# EasyEDA Pro project ProPrj_Syntheseproject 2025-2026_2025-11-26 (1).epro

# Schematic Schematic1

## Sheets
1 Totaal: Board Name: Board1; Create Date: 2025-10-10; Page Name: Totaal; Project Name: Syntheseproject 2025-2026; Schematic Name: Schematic1; Update Date: 2025-10-24; Company: EasyEDA.com; Page Size: A4; Version: V1.0
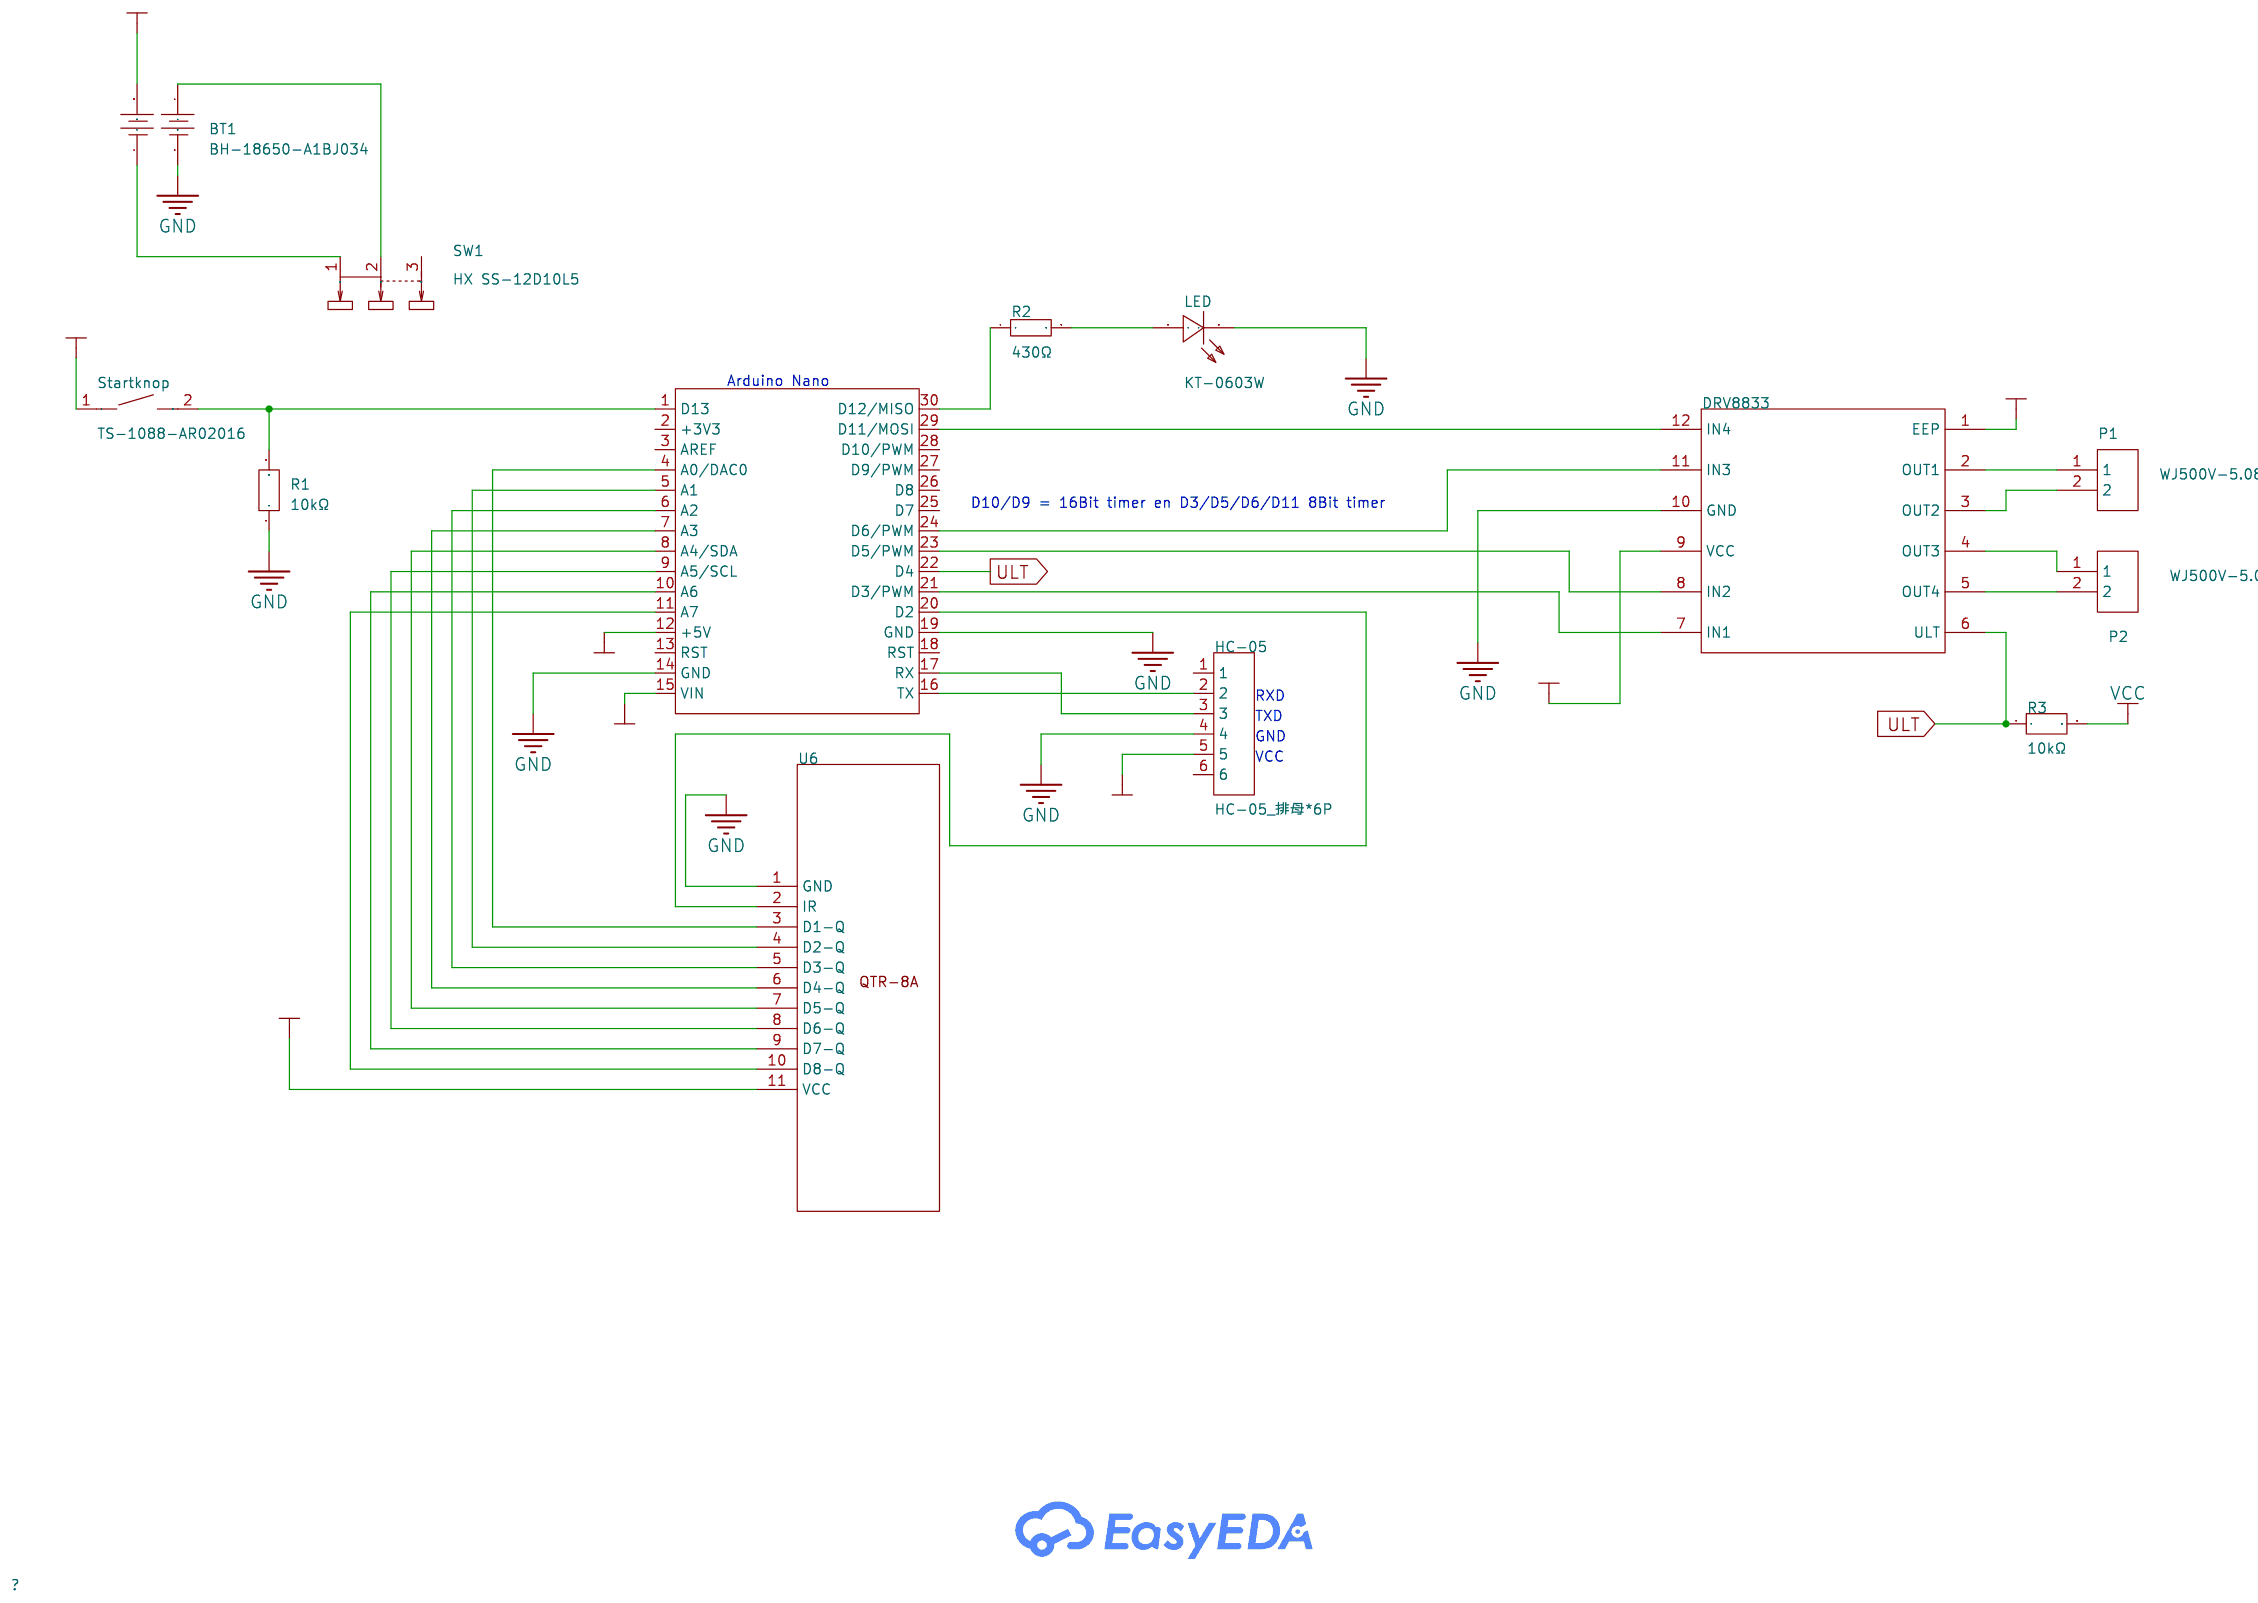
[diagram p0: Totaal]
2 Deelschema-Drive: Create Date: 2025-10-17; Page Name: Deelschema-Drive; Update Date: 2025-10-17
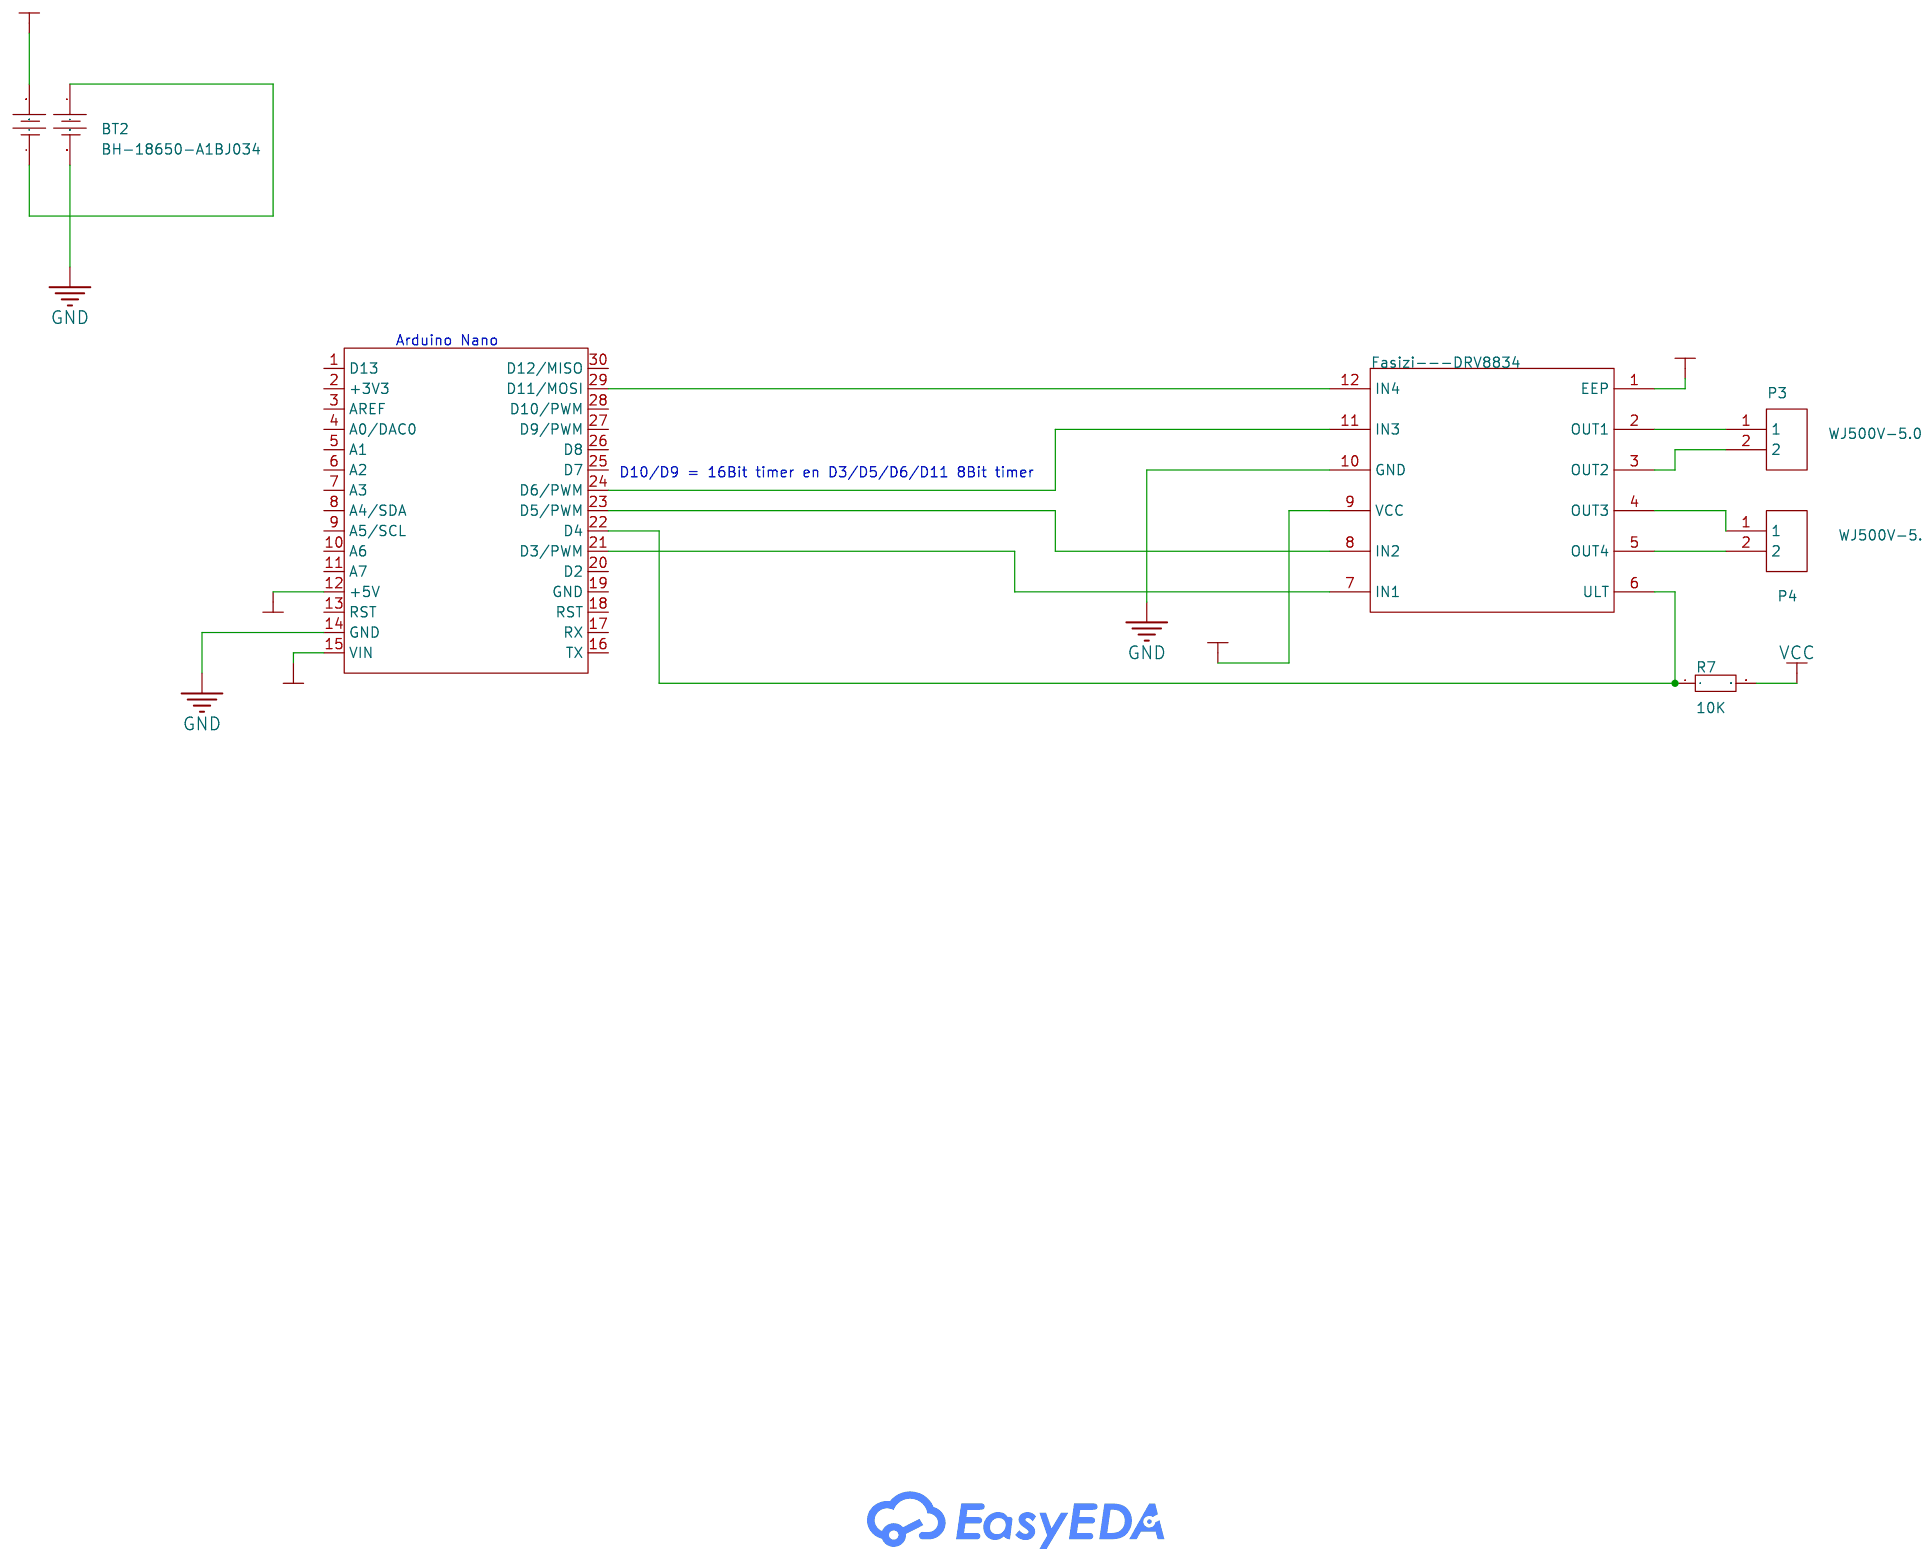
[diagram p1: Deelschema-Drive]
3 Deelschema-QTR-8A: Create Date: 2025-10-17; Page Name: Deelschema-QTR-8A; Update Date: 2025-10-17
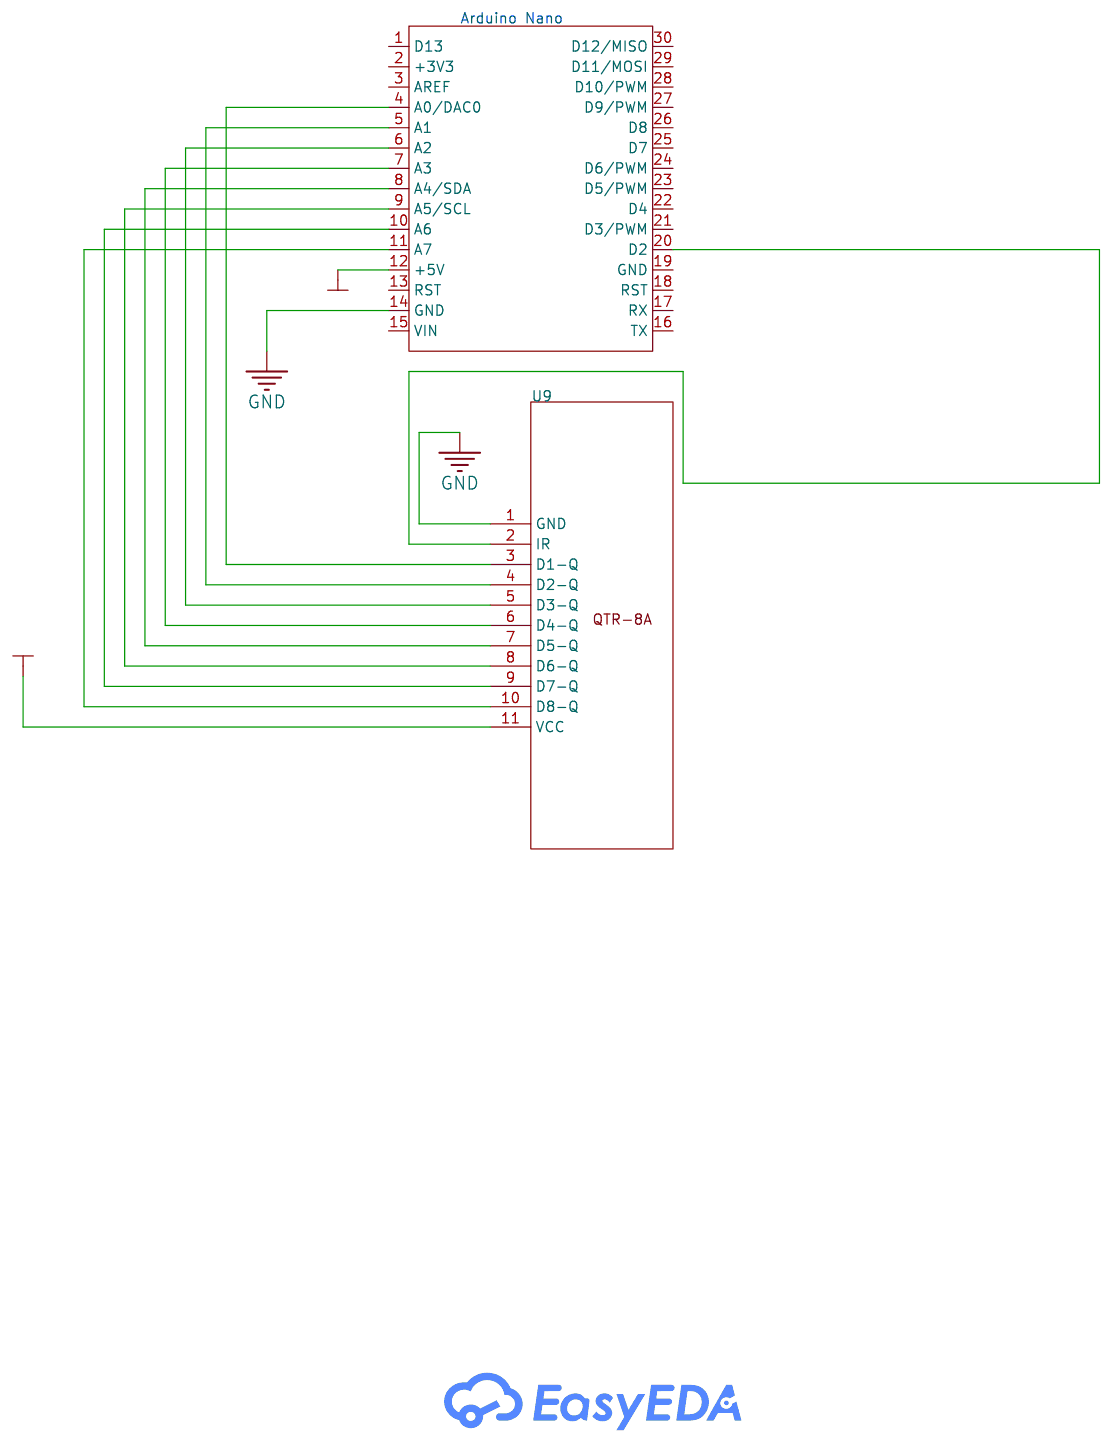
[diagram p2: Deelschema-QTR-8A]
4 Deelschema-HC05: Create Date: 2025-10-17; Page Name: Deelschema-HC05; Update Date: 2025-10-17
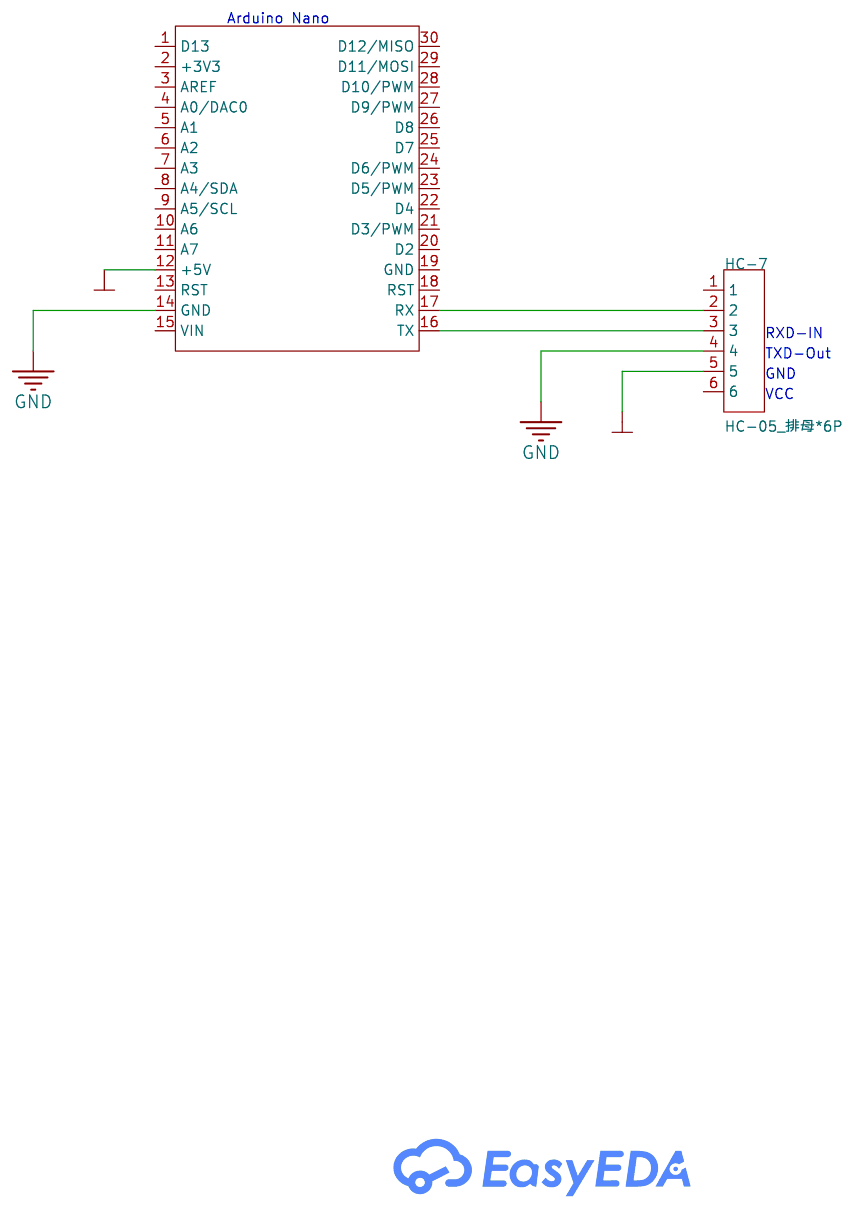
[diagram p3: Deelschema-HC05]
5 Deelschema-intterupt: Create Date: 2025-11-23; Page Name: Deelschema-intterupt; Update Date: 2025-11-23
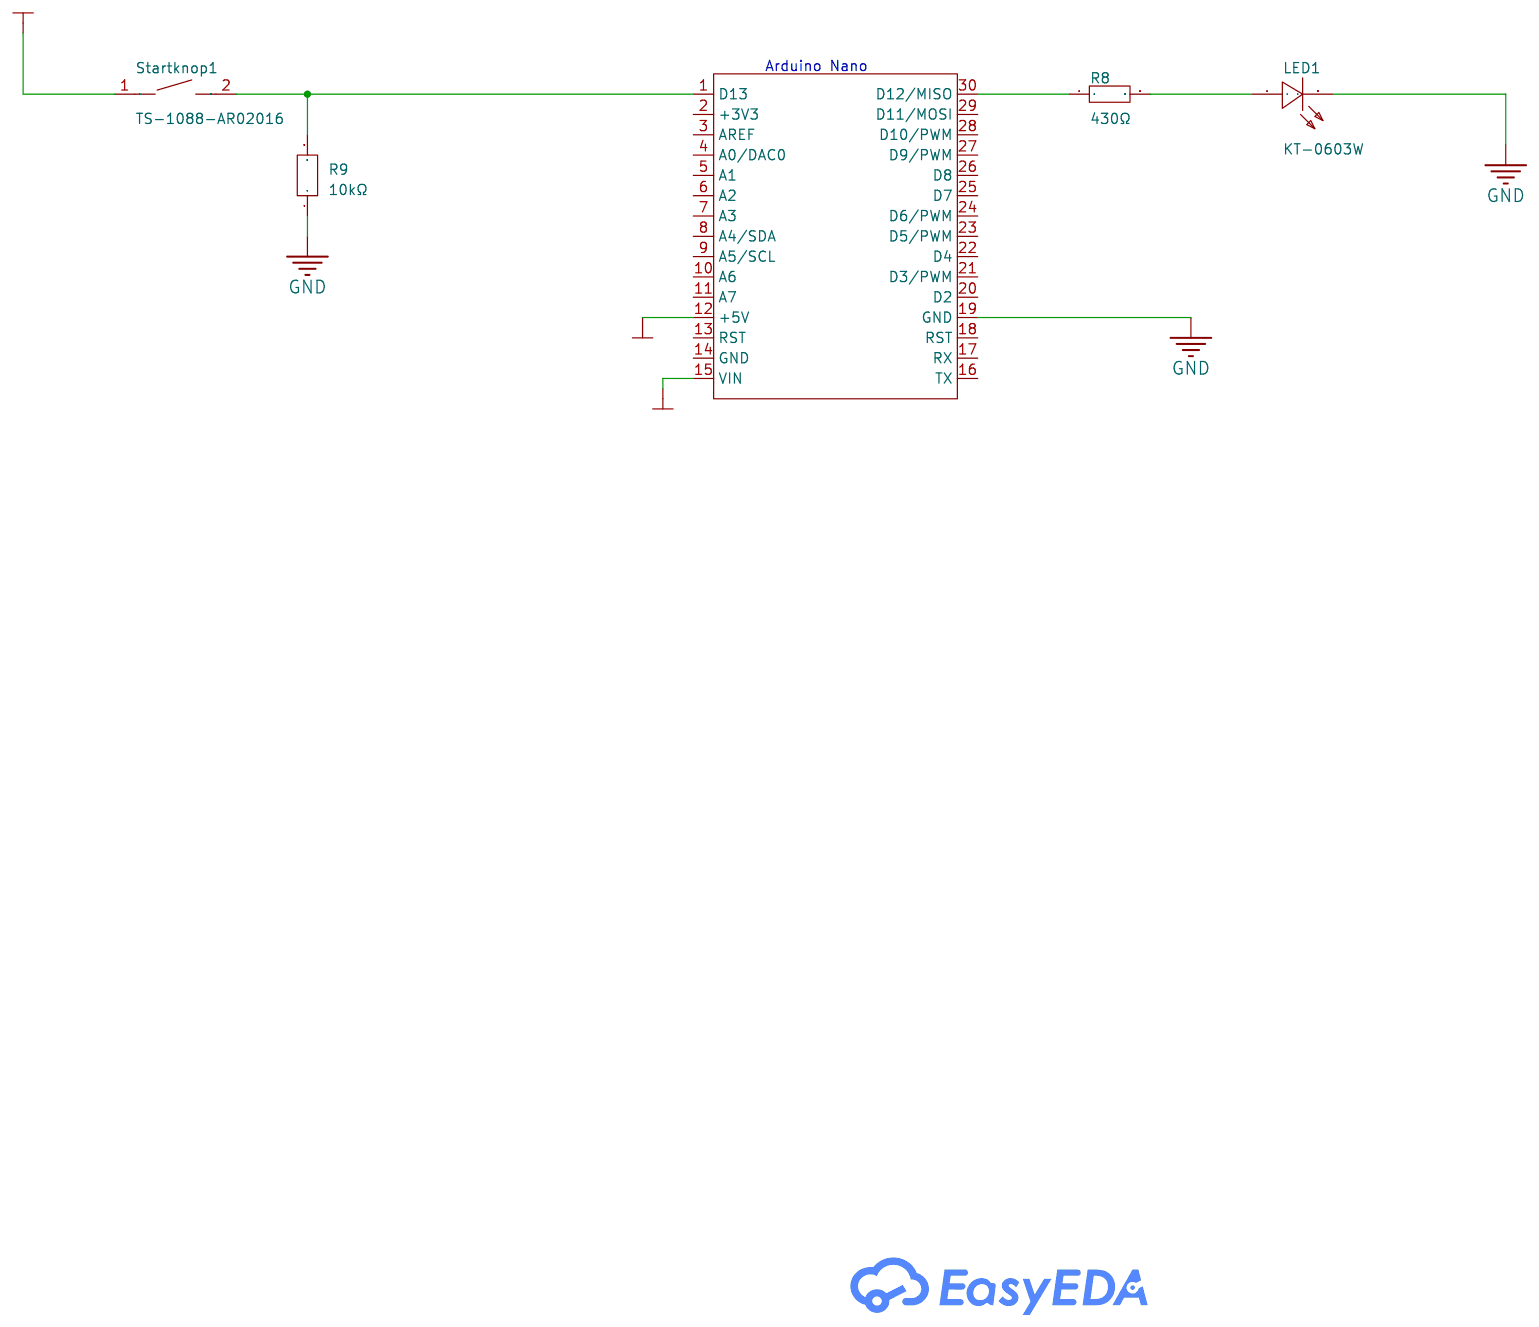
[diagram p4: Deelschema-intterupt]

## Parts
sheet Deelschema-Drive
BT2  BH-18650-A1BJ034  [BAT-TH_BH-18650-A1BJ034]
Fasizi---DRV8834  -  [DRV8833]
P3  WJ500V-5.08-2P  [CONN-TH_2P-P5.00_WJ500V-5.08-2P]
P4  WJ500V-5.08-2P  [CONN-TH_2P-P5.00_WJ500V-5.08-2P]
R7  10K  [R0603]
U7  ABX00028  [MOD-TH_ABX00028]
sheet Deelschema-HC05
HC-7  HC-05_排母*6P  [HDR-TH_6P-P2.50-V-F-R1-C6]
U10  ABX00028  [MOD-TH_ABX00028]
sheet Deelschema-intterupt
LED1  KT-0603W  [LED0603-R-RD_WHITE]
R8  430Ω  [RES-TH_BD1.8-L3.2-P7.20-D0.4]
R9  10kΩ  [RES-TH_BD2.7-L6.2-P10.20-D0.4]
Startknop1  TS-1088-AR02016  [SW-SMD_L3.9-W3.0-P4.45]
U11  ABX00028  [MOD-TH_ABX00028]
sheet Deelschema-QTR-8A
U8  ABX00028  [MOD-TH_ABX00028]
U9  -  [QTR 8A HYS301]
sheet Totaal
BT1  BH-18650-A1BJ034  [BAT-TH_BH-18650-A1BJ034]
DRV8833  -  [DRV8833]
HC-05  HC-05_排母*6P  [HDR-TH_6P-P2.50-V-F-R1-C6]
LED  KT-0603W  [LED0603-R-RD_WHITE]
P1  WJ500V-5.08-2P  [CONN-TH_2P-P5.00_WJ500V-5.08-2P]
P2  WJ500V-5.08-2P  [CONN-TH_2P-P5.00_WJ500V-5.08-2P]
R1  10kΩ  [RES-TH_BD2.7-L6.2-P10.20-D0.4]
R2  430Ω  [RES-TH_BD1.8-L3.2-P7.20-D0.4]
R3  10kΩ  [RES-TH_BD2.7-L6.2-P10.20-D0.4]
Startknop  TS-1088-AR02016  [SW-SMD_L3.9-W3.0-P4.45]
SW1  HX SS-12D10L5  [SW-TH_HX-SS-12D10L5]
U1  ABX00028  [MOD-TH_ABX00028]
U6  -  [QTR 8A HYS301]

## Library data of the parts
BT1 BT2 = BH-18650-A1BJ034: LCSC Part Name: 电池盒BH-18650-2J Ni DIP PA66并联; Supplier Part: C49215506; Manufacturer: MYOUNG(美阳); Supplier Footprint: 插件; JLCPCB Part Class: Extended Part; Datasheet: https://atta.szlcsc.com/upload/public/pdf/source/20250617/4151303E7AA7EBA0276DAFCC12147180.pdf; Supplier: LCSC
DRV8833 Fasizi---DRV8834 = DRV8833: _: 3
P1-P4 = WJ500V-5.08-2P: Structure:1x2P Pitch:5.08mm Color:Green Mounting Style:Direct Insert Current Rating (Max):18A Voltage Rating (Max):250V Number of Pins:2P Number of Rows:1 Wire Gauge - AWG:14~30 Wire Gauge - AWG:14~30 Wire Gauge - mm2:2.5 Wire Gauge - mm2:2.5 Number of PI; LCSC Part Name: 1x2P 5.08mm 直插 排数:1 每排P数:2; Supplier Part: C8465; Manufacturer: KANGNEX(康奈克斯电气); Supplier Footprint: 插件,P=5.08mm; JLCPCB Part Class: Extended Part; Datasheet: https://atta.szlcsc.com/upload/public/pdf/source/20191225/C8465_02D34CE5B5B4A53DF5891601D97FA9F4.pdf; Supplier: LCSC; Structure: 1x2P; Pitch: 5.08mm; Color: Green; Mounting Style: Direct Insert; Current Rating (Max): 18A; Voltage Rating (Max): 250V; Number of Pins: 2P; Number of Rows: 1; Wire Gauge - AWG: 14~30; Wire Gauge - mm2: 2.5; Number of PINs Per Row: 2; Operating Temperature Range: -40℃~+105℃; Screw Specification: M2.5
R7 = Res_0603: Supplier Footprint: 0603
U1 U7 U8 U10 U11 = ABX00028: Supplier Part: C21303176; Manufacturer: arduino; JLCPCB Part Class: Extended Part; Datasheet: https://item.szlcsc.com/datasheet/ABX00028/22723606.html; Supplier: LCSC
HC-05 HC-7 = HC-05_排母*6P: Supplier Part: C9900003093; Supplier Footprint: TH-6_2.5X15.6X2.54P; JLCPCB Part Class: Extended Part; Supplier: LCSC
LED LED1 = KT-0603W: Illumination Color:White Voltage - Forward(Vf):2.6V~3.1V Voltage - Forward(Vf):2.6V~3.1V Power(Watts):100mW Forward Current:5mA Luminous Intensity:360mcd Luminous Intensity:360mcd Viewing Angle:120°; LCSC Part Name: 0603 白灯 高亮; Supplier Part: C2290; Manufacturer: KENTO; Supplier Footprint: 0603; JLCPCB Part Class: Basic Part; Datasheet: https://item.szlcsc.com/datasheet/KT-0603W/2663.html; Supplier: LCSC; Illumination Color: White; Voltage - Forward(Vf): 2.6V~3.1V; Power(Watts): 100mW; Forward Current: 5mA; Luminous Intensity: 360mcd; Viewing Angle: 120°
R2 R8 = MF1/8W-430Ω±1% T: Type:Metal Film Resistors Resistance: Tolerance:±1% Tolerance:±1% Voltage-Supply(Max):150V Power(Watts):125mW Temperature Coefficient:±100ppm/℃ Temperature Coefficient:±100ppm/℃ Operating Temperature:-55℃~+155℃ Operating Temperature:-55℃~+155℃; LCSC Part Name: 430Ω ±1% 125mW 金属膜电阻; Supplier Part: C119170; Manufacturer: CCO(千志电子); Supplier Footprint: 插件,D1.8xL3.2mm; JLCPCB Part Class: Extended Part; Datasheet: https://atta.szlcsc.com/upload/public/pdf/source/20190910/C427326_62A6D058BC0FF74963A2F22379CA06CE.pdf; Supplier: LCSC; Type: Metal Film Resistors; Tolerance: ±1%; Voltage-Supply(Max): 150V; Power(Watts): 125mW; Temperature Coefficient: ±100ppm/℃; Operating Temperature: -55℃~+155℃
R1 R3 R9 = MF1/4W-10K±1%-ST52: Type:Metal Film Resistor Resistance:10kΩ Tolerance:±1% Tolerance:±1% Voltage-Supply(Max):250V Power(Watts):250mW Temperature Coefficient:±100ppm/℃ Temperature Coefficient:±100ppm/℃ Operating Temperature:-55℃~+155℃ Operating Temperature:-55℃~+155℃; LCSC Part Name: 金属膜电阻 10kΩ ±1% 250mW; Supplier Part: C2903232; Manufacturer: VO(翔胜); Supplier Footprint: 插件,D2.7xL6.2mm; JLCPCB Part Class: Extended Part; Datasheet: https://atta.szlcsc.com/upload/public/pdf/source/20200609/C601728_5AA4C0C8E12E11069DA2C3356F29D1F2.pdf; Supplier: LCSC; Type: Metal Film Resistor; Tolerance: ±1%; Voltage-Supply(Max): 250V; Power(Watts): 250mW; Temperature Coefficient: ±100ppm/℃; Operating Temperature: -55℃~+155℃
Startknop Startknop1 = TS-1088-AR02016: Circuit:SPST Actuator Style:Round Button Operating Force:1.6N Mounting Type:Surface Mount,Vertical Length:4mm Width:3mm Switch Height:2mm with Bracket:Without Bracket Contact Current:50mA Voltage Rating:12V Actuator/Cap Color:Black Termination Style:SMD(S; LCSC Part Name: 4*3*2mm 立贴 轻触开关; Supplier Part: C720477; Manufacturer: XUNPU(讯普); Supplier Footprint: SMD; JLCPCB Part Class: Basic Part; Datasheet: https://item.szlcsc.com/datasheet/TS-1088-AR02016/763484.html; Supplier: LCSC; Circuit: SPST; Actuator Style: Round Button; Operating Force: 1.6N; Mounting Type: Surface Mount,Vertical; Length: 4mm; Width: 3mm; Switch Height: 2mm; with Bracket: Without Bracket; Contact Current: 50mA; Voltage Rating: 12V; Actuator/Cap Color: Black; Termination Style: SMD(SMT) Tab; Life: 100,000 Cycles; Operating Temperature: -30℃~+80℃
U6 U9 = QTR 8A HYS301
SW1 = HX SS-12D10L5: Circuit:SPDT Actuator Style:Rectangular Columnar Termination Style:PC Pin Length:12.7mm Width:6.7mm Switch Height:6.4mm Mounting Type:Right Angle Actuator Color:Black Current Rating:2A Voltage Rating:125V Life:5,000 Cycles Operating Temperature:-25℃~+70℃; LCSC Part Name: 两档立式拨动柄长5mm 大电流2A; Supplier Part: C42391667; Manufacturer: hanxia(韩下); Supplier Footprint: SIP-3P,12.7x6.7mm; JLCPCB Part Class: Extended Part; Datasheet: https://item.szlcsc.com/datasheet/HX%2520SS-12D10L5/44326939.html; Supplier: LCSC; Circuit: SPDT; Actuator Style: Rectangular Columnar; Termination Style: PC Pin; Length: 12.7mm; Width: 6.7mm; Switch Height: 6.4mm; Mounting Type: Right Angle; Actuator Color: Black; Current Rating: 2A; Voltage Rating: 125V; Life: 5,000 Cycles; Operating Temperature: -25℃~+70℃

## Nets
GND: BT1.2 BT2.2 DRV8833.10(GND) Fasizi---DRV8834.10(GND) HC-05.4 HC-7.4 LED.2(K) LED1.2(K) R1.1 R9.1 U1.14(GND) U1.19(GND) U6.1(GND) U7.14(GND) U8.14(GND) U9.1(GND) U10.14(GND) U11.19(GND)
VBAT: BT1.3 BT2.3 DRV8833.9(VCC) Fasizi---DRV8834.9(VCC) U1.15(VIN) U7.15(VIN) U11.15(VIN)
VCC: DRV8833.1(EEP) Fasizi---DRV8834.1(EEP) HC-05.5 HC-7.5 R3.2 R7.2 Startknop.1 Startknop1.1 U1.12(+5V) U6.11(VCC) U7.12(+5V) U8.12(+5V) U9.11(VCC) U10.12(+5V) U11.12(+5V)
ULT: DRV8833.6(ULT) R3.1 U1.22(D4)
Net-(BT1-1): BT1.1 SW1.2
Net-(BT1-4): BT1.4 SW1.1
Net-(BT2-1): BT2.1 BT2.4
Net-(DRV8833-2): DRV8833.2(OUT1) P1.1
Net-(DRV8833-3): DRV8833.3(OUT2) P1.2
Net-(DRV8833-4): DRV8833.4(OUT3) P2.1
Net-(DRV8833-5): DRV8833.5(OUT4) P2.2
Net-(DRV8833-7): DRV8833.7(IN1) U1.21(D3/PWM)
Net-(DRV8833-8): DRV8833.8(IN2) U1.23(D5/PWM)
Net-(DRV8833-11): DRV8833.11(IN3) U1.24(D6/PWM)
Net-(DRV8833-12): DRV8833.12(IN4) U1.29(D11/MOSI)
Net-(Fasizi---DRV8834-2): Fasizi---DRV8834.2(OUT1) P3.1
Net-(Fasizi---DRV8834-3): Fasizi---DRV8834.3(OUT2) P3.2
Net-(Fasizi---DRV8834-4): Fasizi---DRV8834.4(OUT3) P4.1
Net-(Fasizi---DRV8834-5): Fasizi---DRV8834.5(OUT4) P4.2
Net-(Fasizi---DRV8834-6): Fasizi---DRV8834.6(ULT) R7.1 U7.22(D4)
Net-(Fasizi---DRV8834-7): Fasizi---DRV8834.7(IN1) U7.21(D3/PWM)
Net-(Fasizi---DRV8834-8): Fasizi---DRV8834.8(IN2) U7.23(D5/PWM)
Net-(Fasizi---DRV8834-11): Fasizi---DRV8834.11(IN3) U7.24(D6/PWM)
Net-(Fasizi---DRV8834-12): Fasizi---DRV8834.12(IN4) U7.29(D11/MOSI)
Net-(HC-05-2): HC-05.2 U1.16(TX)
Net-(HC-05-3): HC-05.3 U1.17(RX)
Net-(HC-7-2): HC-7.2 U10.17(RX)
Net-(HC-7-3): HC-7.3 U10.16(TX)
Net-(LED1-1): LED1.1(A) R8.2
Net-(LED-1): LED.1(A) R2.2
Net-(R1-2): R1.2 Startknop.2 U1.1(D13)
Net-(R2-1): R2.1 U1.30(D12/MISO)
Net-(R8-1): R8.1 U11.30(D12/MISO)
Net-(R9-2): R9.2 Startknop1.2 U11.1(D13)
Net-(U1-4): U1.4(A0/DAC0) U6.3(D1-Q)
Net-(U1-5): U1.5(A1) U6.4(D2-Q)
Net-(U1-6): U1.6(A2) U6.5(D3-Q)
Net-(U1-7): U1.7(A3) U6.6(D4-Q)
Net-(U1-8): U1.8(A4/SDA) U6.7(D5-Q)
Net-(U1-9): U1.9(A5/SCL) U6.8(D6-Q)
Net-(U1-10): U1.10(A6) U6.9(D7-Q)
Net-(U1-11): U1.11(A7) U6.10(D8-Q)
Net-(U1-20): U1.20(D2) U6.2(IR)
Net-(U8-4): U8.4(A0/DAC0) U9.3(D1-Q)
Net-(U8-5): U8.5(A1) U9.4(D2-Q)
Net-(U8-6): U8.6(A2) U9.5(D3-Q)
Net-(U8-7): U8.7(A3) U9.6(D4-Q)
Net-(U8-8): U8.8(A4/SDA) U9.7(D5-Q)
Net-(U8-9): U8.9(A5/SCL) U9.8(D6-Q)
Net-(U8-10): U8.10(A6) U9.9(D7-Q)
Net-(U8-11): U8.11(A7) U9.10(D8-Q)
Net-(U8-20): U8.20(D2) U9.2(IR)

Not connected (* = marked no-connect by the designer): HC-05 1 6; HC-7 1 6; SW1 3; U1 2(+3V3) 3(AREF) 13(RST) 18(RST) 25(D7) 26(D8) 27(D9/PWM) 28(D10/PWM); U7 1(D13) 2(+3V3) 3(AREF) 4(A0/DAC0) 5(A1) 6(A2) 7(A3) 8(A4/SDA) 9(A5/SCL) 10(A6) 11(A7) 13(RST) 16(TX) 17(RX) 18(RST) 19(GND) 20(D2) 25(D7) 26(D8) 27(D9/PWM) 28(D10/PWM) 30(D12/MISO); U8 1(D13) 2(+3V3) 3(AREF) 13(RST) 15(VIN) 16(TX) 17(RX) 18(RST) 19(GND) 21(D3/PWM) 22(D4) 23(D5/PWM) 24(D6/PWM) 25(D7) 26(D8) 27(D9/PWM) 28(D10/PWM) 29(D11/MOSI) 30(D12/MISO); U10 1(D13) 2(+3V3) 3(AREF) 4(A0/DAC0) 5(A1) 6(A2) 7(A3) 8(A4/SDA) 9(A5/SCL) 10(A6) 11(A7) 13(RST) 15(VIN) 18(RST) 19(GND) 20(D2) 21(D3/PWM) 22(D4) 23(D5/PWM) 24(D6/PWM) 25(D7) 26(D8) 27(D9/PWM) 28(D10/PWM) 29(D11/MOSI) 30(D12/MISO); U11 2(+3V3) 3(AREF) 4(A0/DAC0) 5(A1) 6(A2) 7(A3) 8(A4/SDA) 9(A5/SCL) 10(A6) 11(A7) 13(RST) 14(GND) 16(TX) 17(RX) 18(RST) 20(D2) 21(D3/PWM) 22(D4) 23(D5/PWM) 24(D6/PWM) 25(D7) 26(D8) 27(D9/PWM) 28(D10/PWM) 29(D11/MOSI)

## Notes on the sheets
sheet 1
- Arduino Nano
- D10/D9 = 16Bit timer en D3/D5/D6/D11 8Bit timer
- RXD
- GND
- TXD
- VCC
sheet 2
- Arduino Nano
- D10/D9 = 16Bit timer en D3/D5/D6/D11 8Bit timer
sheet 3
- Arduino Nano
sheet 4
- Arduino Nano
- RXD-IN
- TXD-Out
- GND
- VCC
sheet 5
- Arduino Nano

# Board PCB5
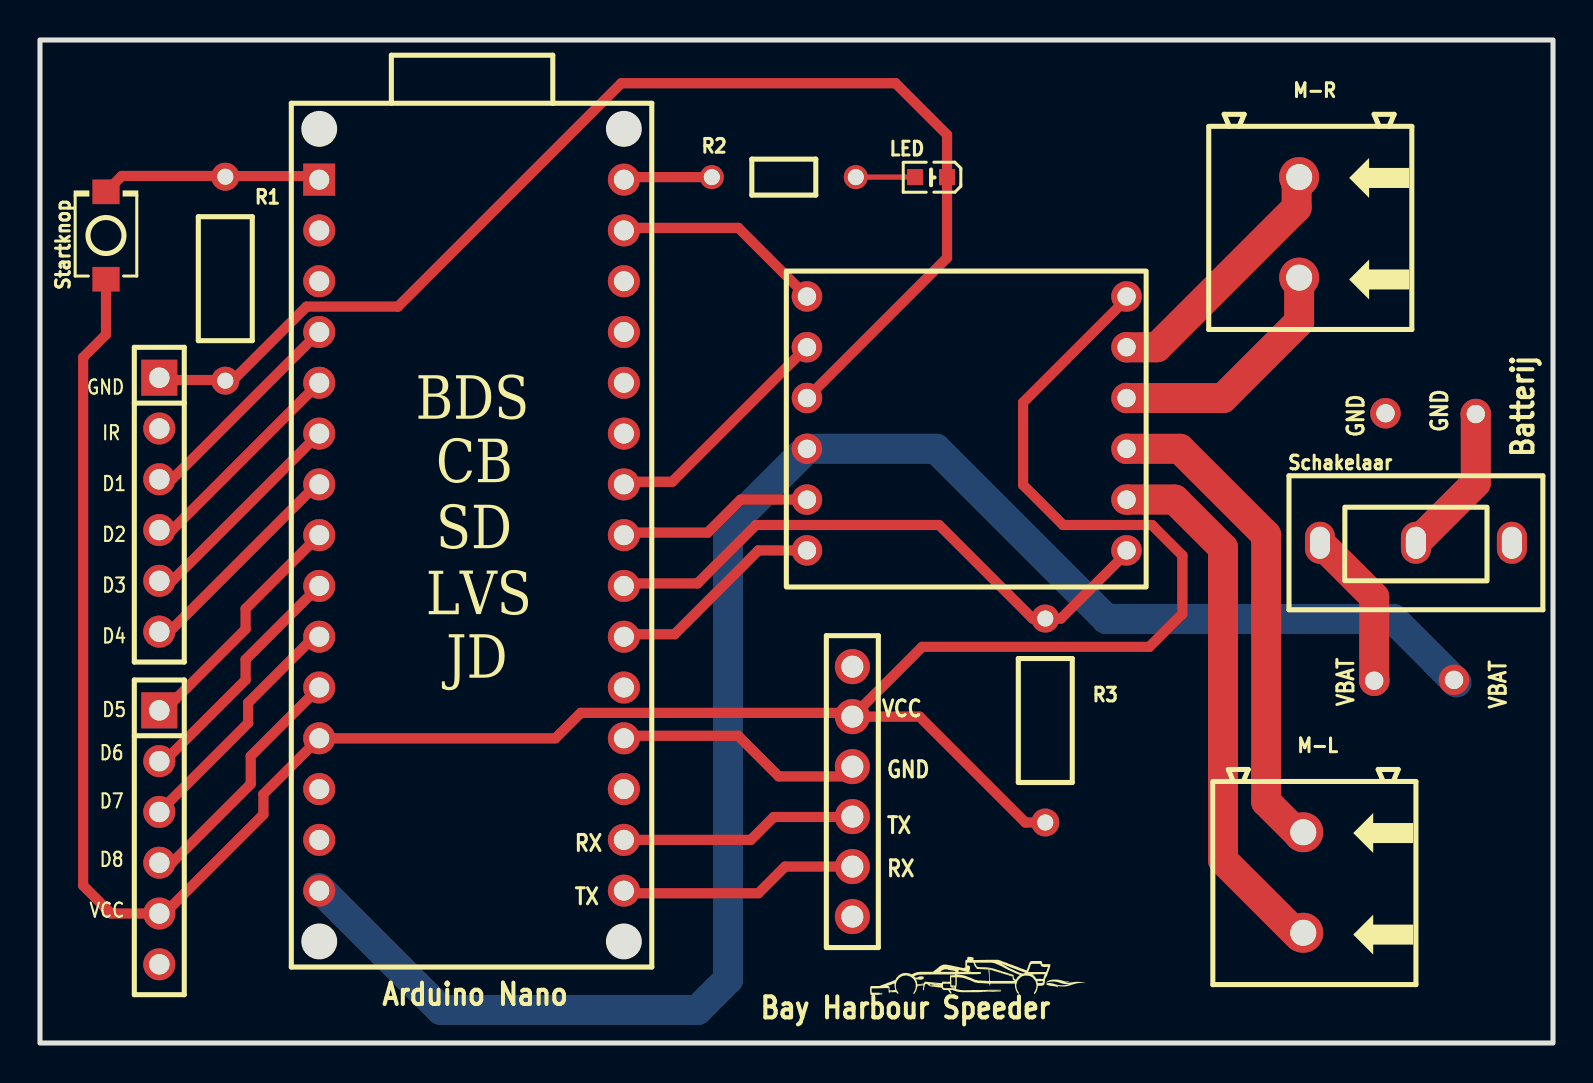
[diagram p5: board, top side]
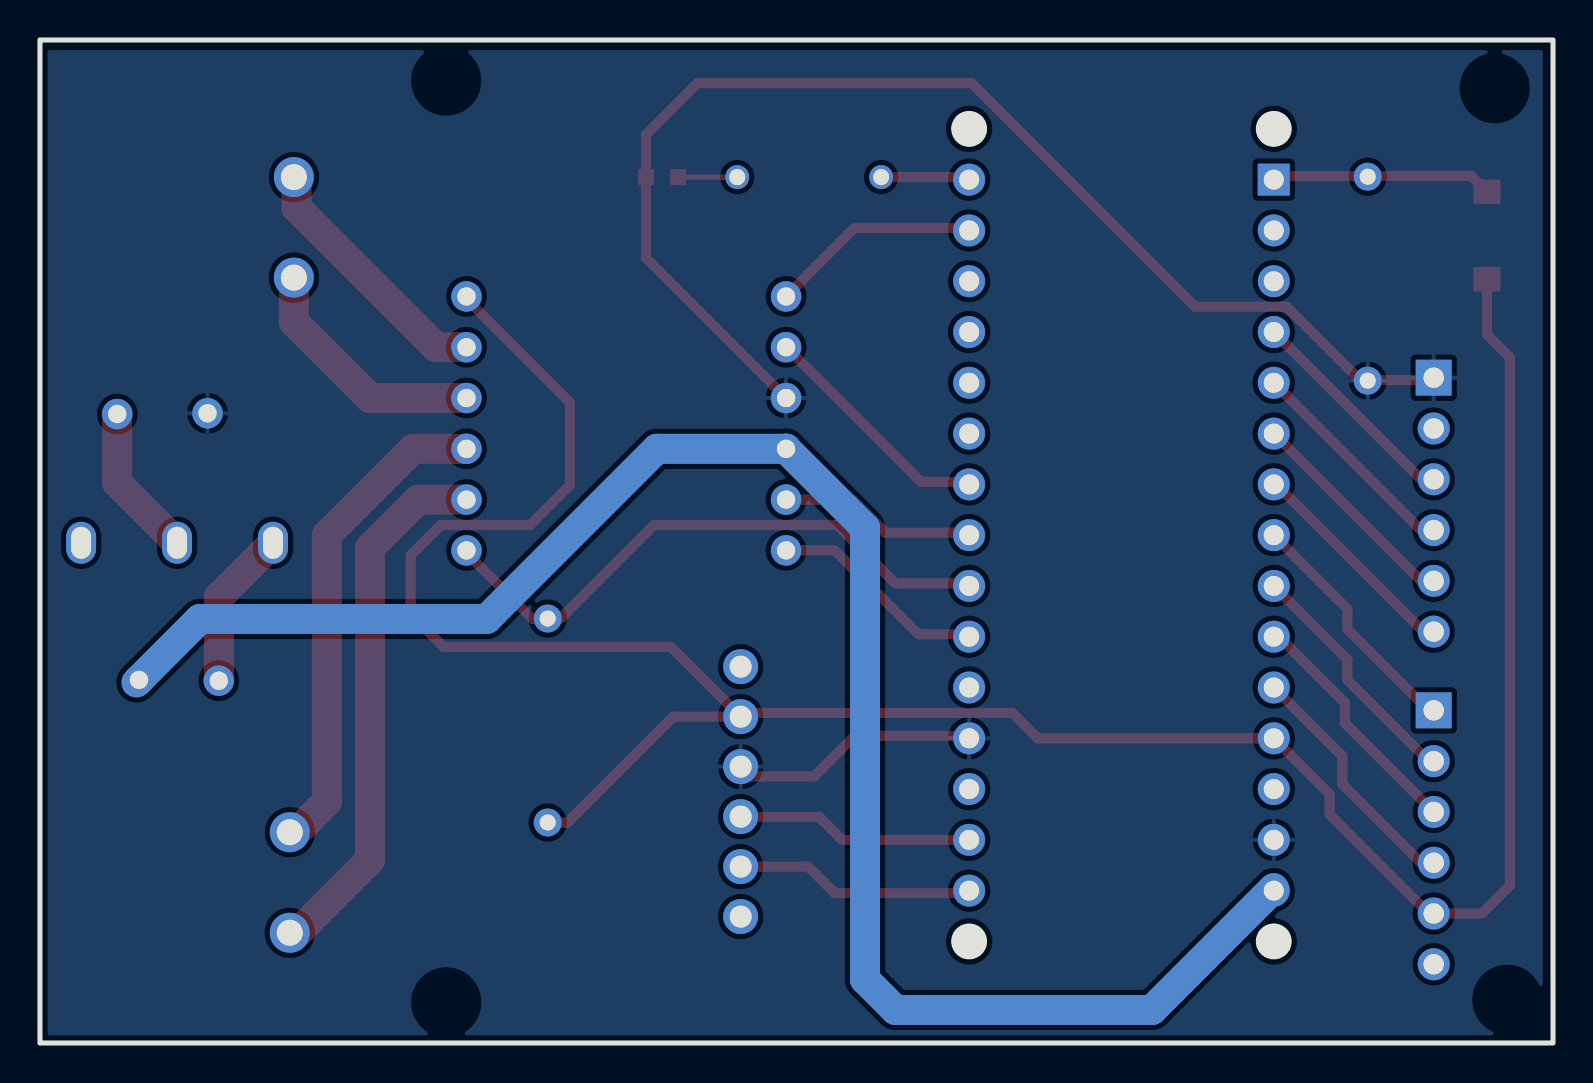
[diagram p6: board, bottom side, seen from below]

Outline 75.69 x 50.16 mm; copper layers: Top Layer, Bottom Layer. Coordinates in mm from the lower left corner of the outline.
Outline path: rectangle 0,50.16 75.69,0
Stack: Top Layer 0.035mm / Dielectric1 1.51mm FR4 er 4.5 / Bottom Layer 0.035mm

## Design rules (mm)
template: JLCPCB Capability(Two Layers Board)
spacing copperThickness1oz (default): track to track 0.102, other pairs 0.152 to 0.3
spacing copperThickness2oz: track to track 0.203, other pairs 0.152 to 0.3
track width copperThickness1oz (default): min 0.127, default 0.254, max 2.54
track width copperThickness2oz: min 0.203, default 0.254, max 2.54
differential pair differentialPair (default): width min 0.127, default 0.254, max 2.54; gap min 0.152, default 0.152
via viaSize (default): diameter min 0.5, default 0.61, max 10; hole min 0.3, default 0.305, max 6.3

## Placement (name value [footprint] x y rotation side)
Fasizi---DRV8833  -  [DRV8833]  37.21 38.73 0 top
H1  -  [HDR-TH_6P-P2.54-V-F]  5.97 26.92 270 top
H2  -  [HDR-TH_6P-P2.54-V-F]  5.97 10.29 270 top
HC-05  HC-05_排母*6P  [HDR-TH_6P-P2.50-V-F-R1-C6]  40.64 12.57 90 top
LED  KT-0603W  [LED0603-R-RD_WHITE]  44.58 43.31 180 top
M-L  WJ500V-5.08-2P  [CONN-TH_2P-P5.00_WJ500V-5.08-2P]  63.2 8 270 top
M-R  WJ500V-5.08-2P  [CONN-TH_2P-P5.00_WJ500V-5.08-2P]  62.99 40.77 270 top
NOREF  -  [Pad_e146]  67.31 31.5 90 top
NOREF#2  -  [Pad_e145]  66.75 18.12 90 top
NOREF#3  -  [Pad_e148]  71.83 31.46 90 top
NOREF#4  -  [Pad_e147]  70.74 18.16 90 top
R1  10kΩ  [RES-TH_BD2.7-L6.2-P10.20-D0.4]  9.27 38.23 270 top
R2  430Ω  [RES-TH_BD1.8-L3.2-P7.20-D0.4]  37.21 43.31 0 top
R3  10kΩ  [RES-TH_BD2.7-L6.2-P10.20-D0.4]  50.29 16.13 270 top
Schakelaar  HX SS-12D10L5  [SW-TH_HX-SS-12D10L5]  68.83 25.02 0 top
Startknop  TS-1088-AR02016  [SW-SMD_L3.9-W3.0-P4.45]  3.3 40.39 90 top
U1  ABX00028  [MOD-TH_ABX00028]  21.59 25.4 0 top

## Footprints (pads in the part's own frame, mm; a bottom-side part is the same pattern mirrored in y, then rotated)
CONN-TH_2P-P5.00_WJ500V-5.08-2P
  round 2 hole 1.3: 1(-2.54,0) 2(2.487,0)
DRV8833
  round 1.524 hole 0.914: 1(17.145,-1.397) 2(17.145,-3.937) 3(17.145,-6.477) 4(17.145,-9.017) 5(17.145,-11.557) 6(17.145,-14.097) 7(1.157,-14.097) 8(1.157,-11.557) 9(1.157,-9.017) 10(1.157,-6.477) 11(1.157,-3.937) 12(1.157,-1.397)
HDR-TH_6P-P2.50-V-F-R1-C6
  round 1.75 hole 1.1: 1(-6.25,0) 2(-3.75,0) 3(-1.25,0) 4(1.25,0) 5(3.75,0) 6(6.25,0)
HDR-TH_6P-P2.54-V-F
  rect 1.8x1.8 hole 1.02: 1(-6.35,0)
  round 1.6 hole 1.02: 2(-3.81,0) 3(-1.27,0) 4(1.27,0) 5(3.81,0) 6(6.35,0)
LED0603-R-RD_WHITE
  rect 0.8x0.8 smd: 1(0.8,0) 2(-0.8,0)
MOD-TH_ABX00028
  rect 1.6x1.6 hole 1: 1(-7.62,17.78)
  round 1.6 hole 1: 2(-7.62,15.24) 3(-7.62,12.7) 4(-7.62,10.16) 5(-7.62,7.62) 6(-7.62,5.08) 7(-7.62,2.54) 8(-7.62,0) 9(-7.62,-2.54) 10(-7.62,-5.08) 11(-7.62,-7.62) 12(-7.62,-10.16) 13(-7.62,-12.7) 14(-7.62,-15.24) 15(-7.62,-17.78) 16(7.62,-17.78) 17(7.62,-15.24) 18(7.62,-12.7) 19(7.62,-10.16) 20(7.62,-7.62) 21(7.62,-5.08) 22(7.62,-2.54) 23(7.62,0) 24(7.62,2.54) 25(7.62,5.08) 26(7.62,7.62) 27(7.62,10.16) 28(7.62,12.7) 29(7.62,15.24) 30(7.62,17.78)
Pad_e145
  round 1.524 hole 0.914: 1(0,0)
Pad_e146
  round 1.524 hole 0.914: 2(0,0)
Pad_e147
  round 1.524 hole 0.914: 3(0,0)
Pad_e148
  round 1.524 hole 0.914: 4(0,0)
RES-TH_BD1.8-L3.2-P7.20-D0.4
  round 1.2 hole 0.8: 1(-3.6,0) 2(3.6,0)
RES-TH_BD2.7-L6.2-P10.20-D0.4
  round 1.4 hole 0.8: 1(-5.1,0) 2(5.1,0)
SW-SMD_L3.9-W3.0-P4.45
  rect 1.23x1.36 smd: 1(-2.185,0) 2(2.185,0)
SW-TH_HX-SS-12D10L5
  oval 1.5x2.1 hole 1x1.6: 1(-4.8,0) 2(0,0) 3(4.8,0)

## Nets
3.3V: U1.2
GND: Fasizi---DRV8833.10 H1.1 HC-05.4 LED.2 NOREF.2 R1.2 U1.14 U1.19
VBAT: Fasizi---DRV8833.9 NOREF#4.3 U1.15
VCC: Fasizi---DRV8833.1 H2.5 HC-05.5 R3.2 Startknop.1 U1.12
A0: H1.3 U1.4
A1: H1.4 U1.5
A2: H1.5 U1.6
A3: H1.6 U1.7
A4: H2.1 U1.8
A5: H2.2 U1.9
A6: H2.3 U1.10
A7: H2.4 U1.11
AREF: U1.3
RX-TX: HC-05.3 U1.17
TX-RX: HC-05.2 U1.16
ULT: Fasizi---DRV8833.6 R3.1 U1.22
$1N796: R1.1 Startknop.2 U1.1
$1N813: Fasizi---DRV8833.2 M-R.1
$1N814: Fasizi---DRV8833.3 M-R.2
$1N815: Fasizi---DRV8833.4 M-L.1
$1N816: Fasizi---DRV8833.5 M-L.2
$1N821: LED.1 R2.2
$1N822: R2.1 U1.30
$1N945: U1.20
$1N3475: Fasizi---DRV8833.11 U1.24
$1N3482: Fasizi---DRV8833.12 U1.29
$1N3502: Fasizi---DRV8833.8 U1.23
$1N3507: Fasizi---DRV8833.7 U1.21

Pads without a net: H1 2; H2 6; HC-05 1 6; NOREF#2 1; NOREF#3 4; Schakelaar 1 2 3; U1 13 18 25 26 27 28

## Routing (per net, layer and track width the routed paths; a pad name or vN(x,y) marks a point on that pad's centre or on a via; arc(x,y) is an arc through that point)
GND: length 75.4
  Top Layer w0.254: 9.54,33.03 9.67,33.16 9.4,33.16
  Top Layer w0.508: 40.77,13.31 40.75,13.33 36.96,13.33 34.93,15.37 29.21,15.37 ; Fasizi---DRV8833.10 45.38,39.27 LED.2 45.38,45.43 42.8,48.01 29.08,48.01 17.91,36.83 13.33,36.83 9.67,33.16 ; 9.4,33.16 5.86,33.16 5.84,33.18
VBAT: length 89.1
  Bottom Layer w1.5: 70.87,18.03 67.69,21.21 53.34,21.21 44.83,29.72 Fasizi---DRV8833.9 34.42,25.77 34.42,3.17 32.89,1.65 20.07,1.65 13.97,7.75
VCC: length 128.5
  Top Layer w0.508: 54.48,37.34 49.18,32.04 49.18,27.91 51.18,25.91 55.63,25.91 57.15,24.38 57.15,21.46 55.5,19.81 44.13,19.81 HC-05.5 ; Startknop.1 3.3,35.43 2.16,34.29 2.16,7.87 3.56,6.48 H2.5 6.22,6.48 11.18,11.43 11.18,12.45 U1.12 25.78,15.24 27.05,16.51 40.33,16.51 40.51,16.32 HC-05.5 ; HC-05.5 44,16.32 49.3,11.03 49.66,11.03
(no net): length 15.7
  Top Layer w1.5: NOREF#3.4 71.83,28.01 Schakelaar.2 ; Schakelaar.1 66.75,22.31 NOREF#2.1
A0: length 11.1
  Top Layer w0.508: U1.4 6.6,28.19 H1.3
A1: length 11.1
  Top Layer w0.508: H1.4 6.6,25.65 U1.5
A2: length 11.1
  Top Layer w0.508: H1.5 6.6,23.11 U1.6
A3: length 11.1
  Top Layer w0.508: H1.6 6.48,20.57 13.84,27.94 U1.7
A4: length 12.2
  Top Layer w0.508: H2.1 6.22,16.64 10.29,20.7 10.29,21.72 U1.8
A5: length 12.2
  Top Layer w0.508: U1.9 10.29,19.18 10.29,18.16 6.22,14.1 H2.2
A6: length 12.2
  Top Layer w0.508: H2.3 10.41,16 10.41,17.02 13.72,20.32 U1.10
A7: length 12.4
  Top Layer w0.508: H2.4 6.6,9.02 10.54,12.95 10.54,14.35 U1.11
RX-TX: length 11.9
  Top Layer w0.508: HC-05.3 40.62,11.3 36.7,11.3 35.56,10.16 U1.17
TX-RX: length 12
  Top Layer w0.508: U1.16 29.34,7.49 35.94,7.49 37.27,8.82 HC-05.2
ULT: length 29.8
  Top Layer w0.508: 29.21,22.99 32.89,22.99 35.81,25.91 44.98,25.91 49.66,21.23 51.07,21.23 54.48,24.64
$1N796: length 11.1
  Top Layer w0.508: U1.1 13.79,43.36 9.4,43.36 9.39,43.37 4.1,43.37 Startknop.2
$1N813: length 12.9
  Top Layer w1.5: 54.48,34.8 55.88,34.8 62.87,41.78 62.87,43.18 M-R.1
$1N814: length 12.3
  Top Layer w1.5: M-R.2 62.99,36.07 59.18,32.26 54.48,32.26
$1N815: length 24.3
  Top Layer w1.5: 54.48,29.72 57.02,29.72 61.34,25.4 61.34,12.06 62.99,10.41
$1N816: length 26.7
  Top Layer w1.5: 62.99,5.33 59.18,9.14 59.18,24.76 56.77,27.18 54.48,27.18
$1N821: length 3
  Top Layer w0.254: R2.2 LED.1
$1N822: length 4.4
  Top Layer w0.508: R2.1 29.21,43.31
$1N3475: length 11.9
  Top Layer w0.508: 29.21,28.07 31.62,28.07 38.35,34.8 Fasizi---DRV8833.11
$1N3482: length 10.6
  Top Layer w0.508: Fasizi---DRV8833.12 34.94,40.77 29.21,40.77
$1N3502: length 9.8
  Top Layer w0.508: 29.21,25.53 33.4,25.53 35.05,27.18 Fasizi---DRV8833.8
$1N3507: length 10.9
  Top Layer w0.508: Fasizi---DRV8833.7 35.94,24.64 31.75,20.45 29.21,20.45

## Copper pours and planes (outline as drawn; the poured copper is in the pictures)
GND on Bottom Layer: 0.51,49.66 75.31,49.66 75.31,0.38 0.51,0.38

## Text on the board
Top Silkscreen Layer: GND | VCC | D6 | D7 | D8 | IR | D1 | D2 | D3 | D4 | D5 | RX | TX | VBAT | Bay Harbour Speeder | Arduino Nano | Batterij | BDS | LVS | CB | SD | JD
